# Altium schematic sheet P01_Block Diagram.SchDoc
size 301 x 239 mm; SheetNumber: 1; SheetTotal: 10
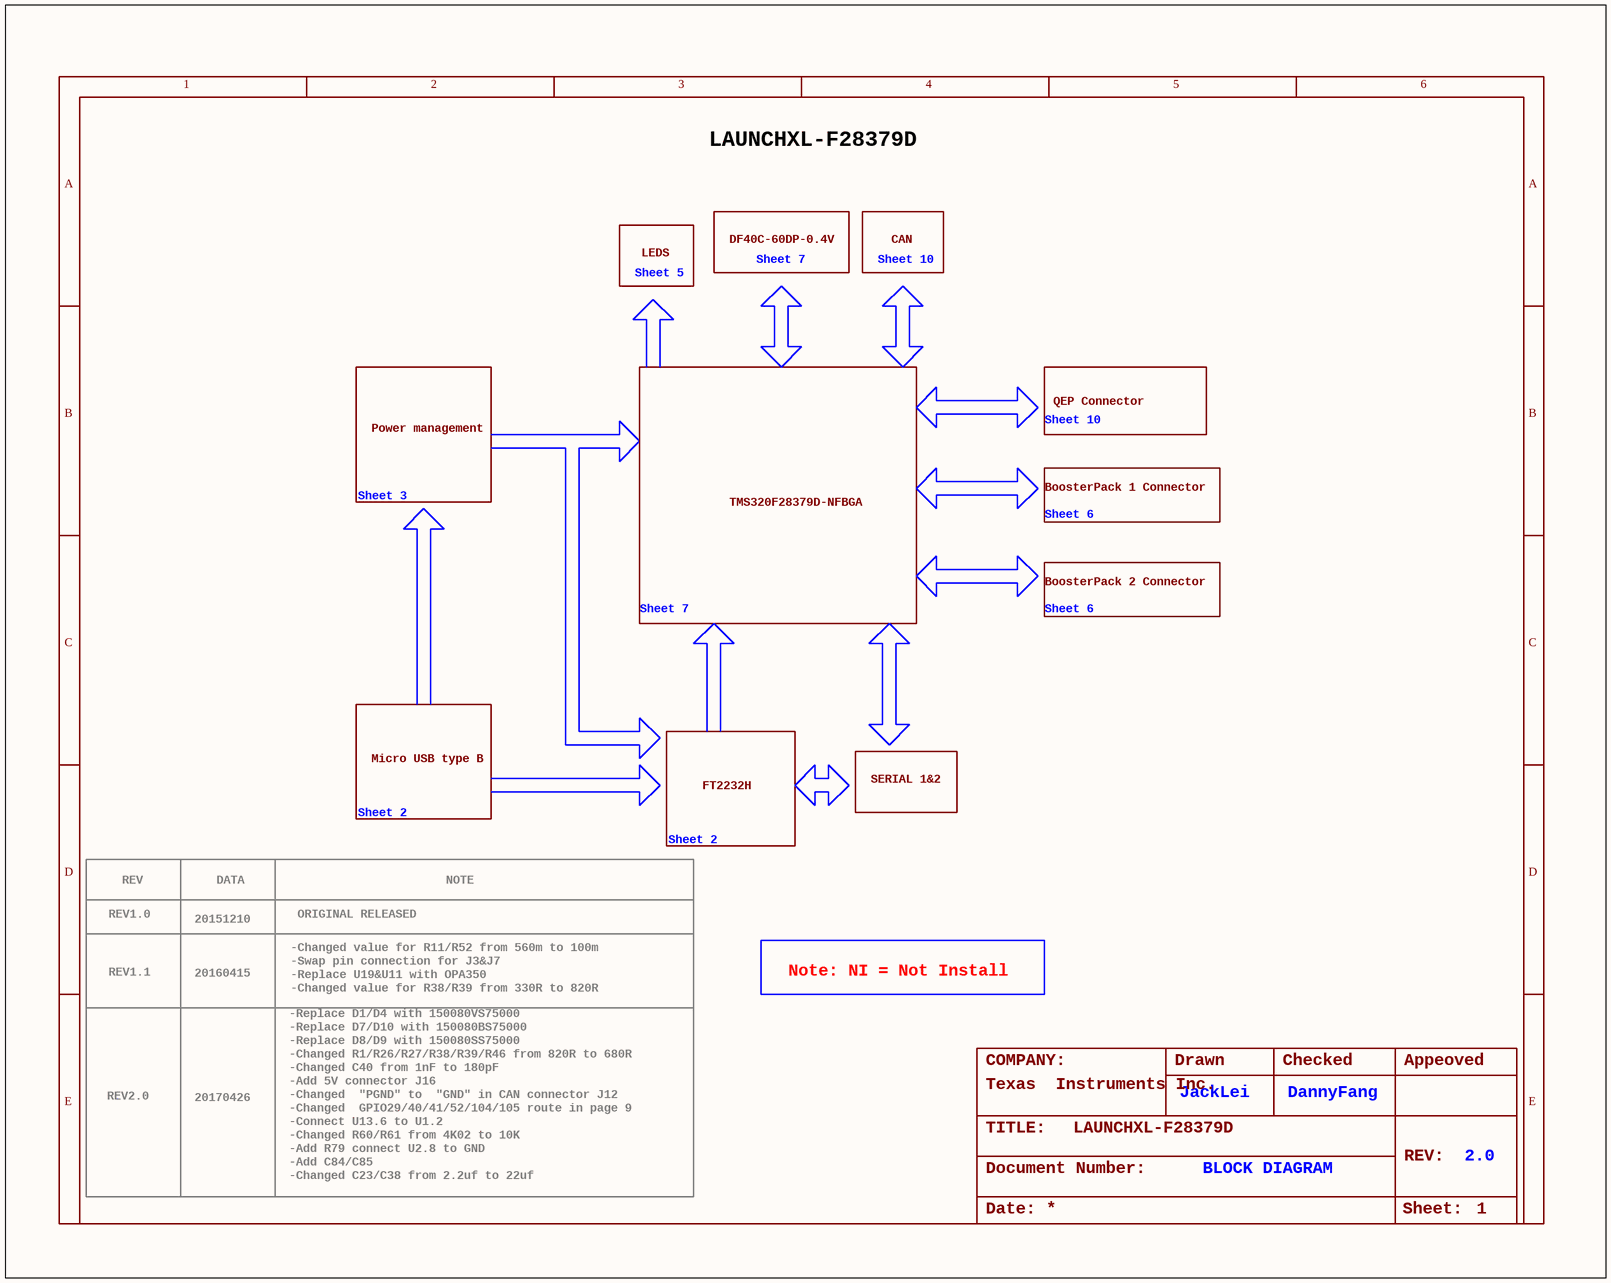
[diagram p0: P01_Block Diagram.SchDoc]

## Notes on the sheet
- LAUNCHXL-F28379D
- Sheet 5
- LEDS
- DF40C-60DP-0.4V
- Sheet 7
- Sheet 10
- CAN
- QEP Connector
- Power management
- BoosterPack 1 Connector
- Sheet 3
- TMS320F28379D-NFBGA
- Sheet 6
- BoosterPack 2 Connector
- Micro USB type B
- Sheet 2
- FT2232H
- SERIAL 1&2
- REV
- DATA
- NOTE
- REV1.0
- 20151210
- -Changed value for R11/R52 from 560m to 100m
- -Swap pin connection for J3&J7
- ORIGINAL RELEASED
- REV1.1
- 20160415
- -Replace D1/D4 with 150080VS75000
- -Replace D7/D10 with 150080BS75000
- -Replace U19&U11 with OPA350
- -Changed value for R38/R39 from 330R to 820R
- Note: NI = Not Install
- REV2.0
- 20170426
- -Add 5V connector J16
- -Changed R1/R26/R27/R38/R39/R46 from 820R to 680R
- -Replace D8/D9 with 150080SS75000
- -Changed C40 from 1nF to 180pF
- -Changed  "PGND" to  "GND" in CAN connector J12
- COMPANY:
- Texas
  Instruments Inc.
- Drawn
- JackLei
- Checked
- DannyFang
- Appeoved
- -Changed  GPIO29/40/41/52/104/105 route in page 9
- -Connect U13.6 to U1.2
- -Changed R60/R61 from 4K02 to 10K
- -Add R79 connect U2.8 to GND
- -Add C84/C85
- TITLE:
- REV:
- 2.0
- -Changed C23/C38 from 2.2uf to 22uf
- Date:
- Document Number:
- BLOCK DIAGRAM
- Sheet:
- 1
- 2
- 3
- 4
- 5
- 6
- A
- B
- C
- D
- E